# Altium schematic sheet ETHERNET_PLEIADES.SchDoc
size Tabloid; SheetNumber: 7; SheetTotal: 10; Sheet_Name: Insert name in Document Parameters; Size: 11x17
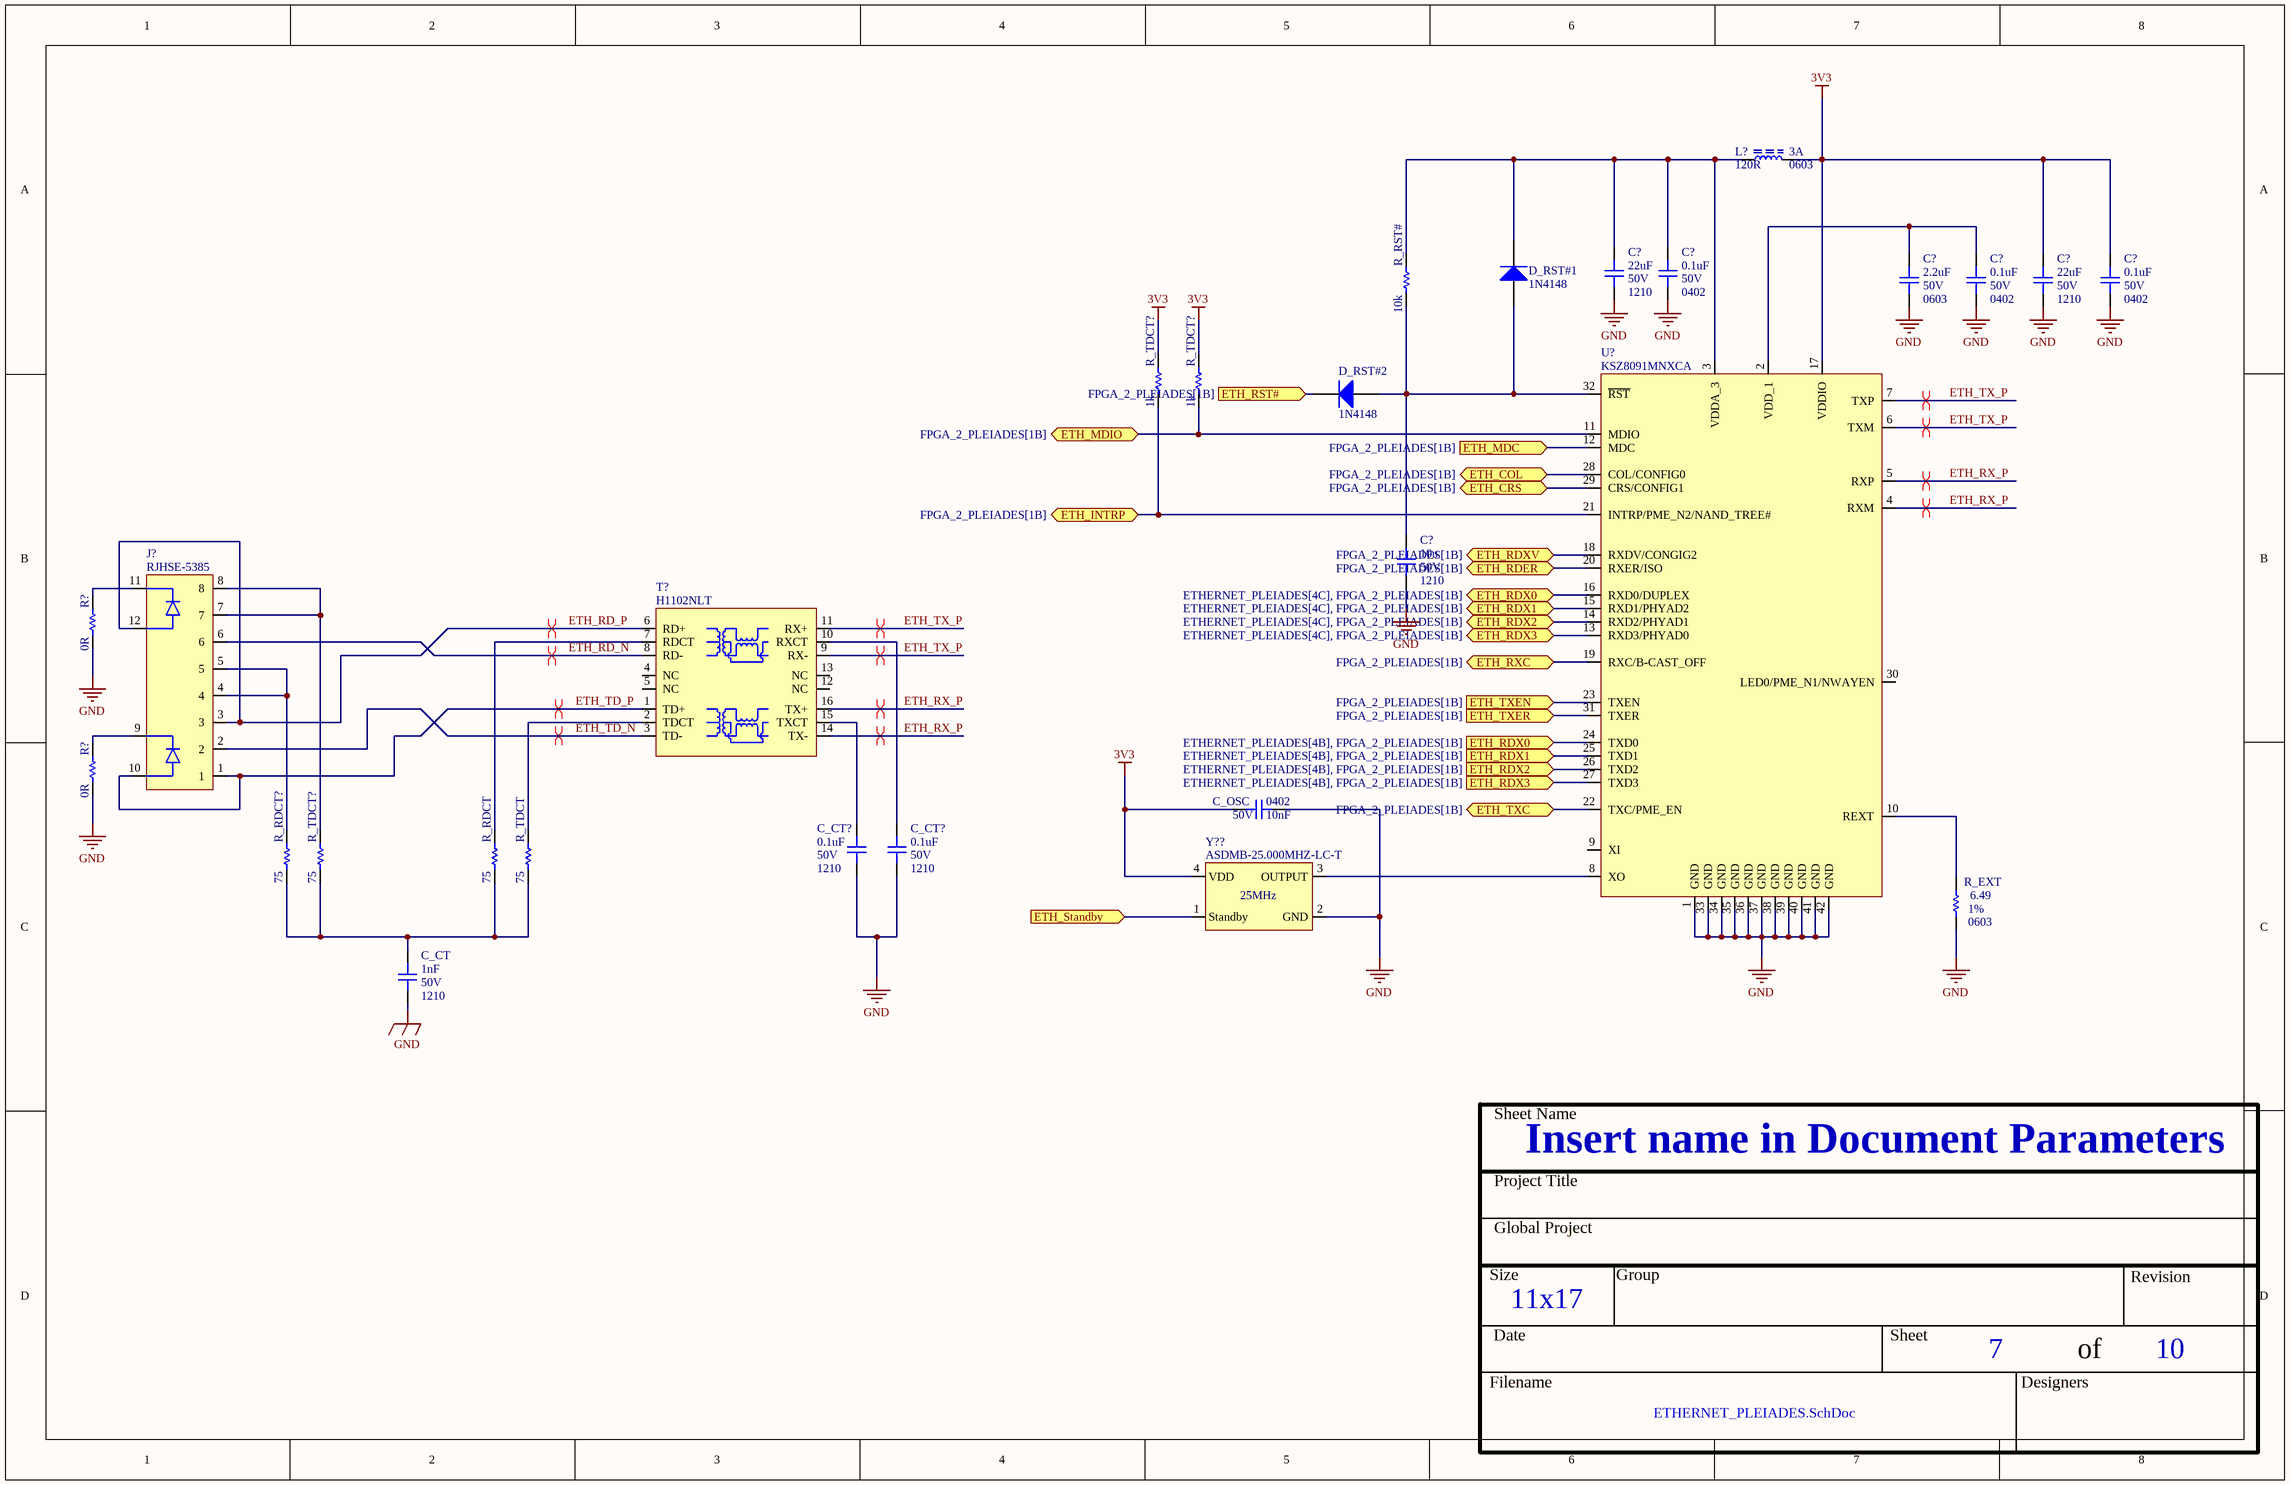
[diagram p0: ETHERNET_PLEIADES.SchDoc]

## Parts
(Parts that share a designator on the sheet are numbered #1, #2 ... from top to bottom, then left to right.)
C?#1  value 22uF  Voltage: 50V  Package: 1210  [CAP_1210]  (hidden comment: CAP - 1210)
C?#2  value 0.1uF  Voltage: 50V  Package: 0402  [CAP_0402]  (hidden comment: CAP - 0402)
C?#3  value 2.2uF  Voltage: 50V  Package: 0603  [CAP_0603]  (hidden comment: CAP - 0603)
C?#4  value 0.1uF  Voltage: 50V  Package: 0402  [CAP_0402]  (hidden comment: CAP - 0402)
C?#5  value 22uF  Voltage: 50V  Package: 1210  [CAP_1210]  (hidden comment: CAP - 1210)
C?#6  value 0.1uF  Voltage: 50V  Package: 0402  [CAP_0402]  (hidden comment: CAP - 0402)
C?#7  value 10u  Voltage: 50V  Package: 1210  [CAP_1210]  (hidden comment: CAP - 1210)
C_CT  value 1nF  Voltage: 50V  Package: 1210  [CAP_1210]  (hidden comment: CAP - 1210)
C_CT?#1  value 0.1uF  Voltage: 50V  Package: 1210  [CAP_1210]  (hidden comment: CAP - 1210)
C_CT?#2  value 0.1uF  Voltage: 50V  Package: 1210  [CAP_1210]  (hidden comment: CAP - 1210)
C_OSC  value 10nF  Voltage: 50V  Package: 0402  [CAP_0402]  (hidden comment: CAP - 0402)
D_RST#1  1N4148  [NXP-SOD27-2_V]
D_RST#2  1N4148  [NXP-SOD27-2_V]
J?  RJHSE-5385  [CONN_ETHERNET_RJHSE-5385]
L?  value 120R  Current: 3A  Package: 0603  [FER_0603]  (hidden comment: FER - 0603)
R?#1  value 0R  [RES_0402]  (hidden comment: RES - 0402)
R?#2  value 0R  [RES_0402]  (hidden comment: RES - 0402)
R_EXT  value 6.49  Package: 0603  Precision: 1%  [RES_0603]  (hidden comment: RES - 0603)
R_RDCT  value 75  [RES_0402]  (hidden comment: RES - 0402)
R_RDCT?  value 75  [RES_0402]  (hidden comment: RES - 0402)
R_RST#  value 10k  [RES_0402]  (hidden comment: RES - 0402)
R_TDCT  value 75  [RES_0402]  (hidden comment: RES - 0402)
R_TDCT?#1  value 1k  [RES_0402]  (hidden comment: RES - 0402)
R_TDCT?#2  value 1k  [RES_0402]  (hidden comment: RES - 0402)
R_TDCT?#3  value 75  [RES_0402]  (hidden comment: RES - 0402)
T?  H1102NLT  [TRANSFO_H1102NLT]
U?  KSZ8091MNXCA  [COM_ETH_PHY_KSZ8091MNXCA]
Y??  ASDMB-25.000MHZ-LC-T  [OSC_ASDMB-25.000MHZ-LC-T]

## Ports
ETH_COL (bidir, see FPGA_2_PLEIADES[1B]), ETH_CRS (bidir, see FPGA_2_PLEIADES[1B]), ETH_INTRP (bidir, see FPGA_2_PLEIADES[1B]), ETH_MDC (in, see FPGA_2_PLEIADES[1B]), ETH_MDIO (bidir, see FPGA_2_PLEIADES[1B]), ETH_RDER (bidir, see FPGA_2_PLEIADES[1B]), ETH_RDX0 (bidir, see ETHERNET_PLEIADES[4C], FPGA_2_PLEIADES[1B]), ETH_RDX0 (in, see ETHERNET_PLEIADES[4B], FPGA_2_PLEIADES[1B]), ETH_RDX1 (bidir, see ETHERNET_PLEIADES[4C], FPGA_2_PLEIADES[1B]), ETH_RDX1 (in, see ETHERNET_PLEIADES[4B], FPGA_2_PLEIADES[1B]), ETH_RDX2 (bidir, see ETHERNET_PLEIADES[4C], FPGA_2_PLEIADES[1B]), ETH_RDX2 (in, see ETHERNET_PLEIADES[4B], FPGA_2_PLEIADES[1B]), ETH_RDX3 (bidir, see ETHERNET_PLEIADES[4C], FPGA_2_PLEIADES[1B]), ETH_RDX3 (in, see ETHERNET_PLEIADES[4B], FPGA_2_PLEIADES[1B]), ETH_RDXV (bidir, see FPGA_2_PLEIADES[1B]), ETH_RST# (in, see FPGA_2_PLEIADES[1B]), ETH_RXC (bidir, see FPGA_2_PLEIADES[1B]), ETH_Standby (in), ETH_TXC (bidir, see FPGA_2_PLEIADES[1B]), ETH_TXEN (in, see FPGA_2_PLEIADES[1B]), ETH_TXER (in, see FPGA_2_PLEIADES[1B])

## Nets
3V3: C?#5.2 C?#6.2 C_OSC.2 L?.1 R_TDCT?#1.2 R_TDCT?#2.2 U?.17(VDDIO) Y??.4(VDD)
GND: C?#1.1 C?#2.1 C?#3.1 C?#4.1 C?#5.1 C?#6.1 C?#7.1 C_CT.1 C_CT?#1.1 C_CT?#2.1 C_OSC.1 R?#1.1 R?#2.1 R_EXT.1 U?.1(GND) U?.33(GND) U?.34(GND) U?.35(GND) U?.36(GND) U?.37(GND) U?.38(GND) U?.39(GND) U?.40(GND) U?.41(GND) U?.42(GND) Y??.2(GND)
ETH_COL: U?.28(COL/CONFIG0) ; port ETH_COL
ETH_CRS: U?.29(CRS/CONFIG1) ; port ETH_CRS
ETH_INTRP: R_TDCT?#1.1 U?.21(INTRP/PME_N2/NAND_TREE#) ; port ETH_INTRP
ETH_MDC: U?.12(MDC) ; port ETH_MDC
ETH_MDIO: R_TDCT?#2.1 U?.11(MDIO) ; port ETH_MDIO
ETH_RD_N: J?.6 T?.8(RD-)
ETH_RD_P: J?.3 J?.12(LED2_A) T?.6(RD+)
ETH_RDER: U?.20(RXER/ISO) ; port ETH_RDER
ETH_RDX0: U?.16(RXD0/DUPLEX) U?.24(TXD0) ; port ETH_RDX0
ETH_RDX1: U?.15(RXD1/PHYAD2) U?.25(TXD1) ; port ETH_RDX1
ETH_RDX2: U?.14(RXD2/PHYAD1) U?.26(TXD2) ; port ETH_RDX2
ETH_RDX3: U?.13(RXD3/PHYAD0) U?.27(TXD3) ; port ETH_RDX3
ETH_RDXV: U?.18(RXDV/CONGIG2) ; port ETH_RDXV
ETH_RST#: D_RST#2.2(K) ; port ETH_RST#
ETH_RX_P: T?.14(TX-) T?.16(TX+) U?.4(RXM) U?.5(RXP)
ETH_RXC: U?.19(RXC/B-CAST_OFF) ; port ETH_RXC
ETH_Standby: Y??.1(Standby) ; port ETH_Standby
ETH_TD_N: J?.2 T?.3(TD-)
ETH_TD_P: J?.1 J?.10(LED1_A) T?.1(TD+)
ETH_TX_P: T?.9(RX-) T?.11(RX+) U?.6(TXM) U?.7(TXP)
ETH_TXC: U?.22(TXC/PME_EN) ; port ETH_TXC
ETH_TXEN: U?.23(TXEN) ; port ETH_TXEN
ETH_TXER: U?.31(TXER) ; port ETH_TXER
NetC?#1_2: C?#1.2 C?#2.2 D_RST#1.2(K) L?.2 R_RST#.2 U?.3(VDDA_3)
NetC?#3_2: C?#3.2 C?#4.2 U?.2(VDD_1)
NetC?#7_2: C?#7.2 D_RST#1.1(A) D_RST#2.1(A) R_RST#.1 U?.32(~{RST})
NetC_CT?#1_2: C_CT?#1.2 T?.15(TXCT)
NetC_CT?#2_2: C_CT?#2.2 T?.10(RXCT)
NetC_CT_2: C_CT.2 R_RDCT.1 R_RDCT?.1 R_TDCT.1 R_TDCT?#3.1
NetJ?_4: J?.4 J?.5 R_RDCT?.2
NetJ?_7: J?.7 J?.8 R_TDCT?#3.2
NetJ?_9: J?.9(LED1_K) R?#2.2
NetJ?_11: J?.11(LED2_K) R?#1.2
NetR_EXT_2: R_EXT.2 U?.10(REXT)
NetR_RDCT_2: R_RDCT.2 T?.7(RDCT)
NetR_TDCT_2: R_TDCT.2 T?.2(TDCT)
NetU?_8: U?.8(XO) Y??.3(OUTPUT)

Not connected (* = marked no-connect by the designer): T? 4(NC) 5(NC) 12(NC) 13(NC); U? 9(XI) 30(LED0/PME_N1/NWAYEN)

## Layout directives
differential pair: ETH_RD_N, ETH_RD_P, ETH_RX_P, ETH_TD_N, ETH_TD_P, ETH_TX_P

## Notes on the sheet
- Sheet Name
- Project Title
- Global Project
- Size
- Group
- Revision
- Date
- Sheet
- of
- Filename
- Designers

## Library data of the parts
C?#1 C?#5 C?#7 C_CT C_CT?#1 C_CT?#2 = CAP - 1210: Precision: 10%; Current: *; CreatedBy: Jonathan Bouchard
  C?#1 C?#5 C?#7 C_CT C_CT?#2: Power: *
  C_CT?#1: Power: 0.1uF
C?#2 C?#4 C?#6 C_OSC = CAP - 0402: Precision: 10%; Current: *; CreatedBy: Jonathan Bouchard; Power: *
C?#3 = CAP - 0603: Precision: 10%; Current: *; CreatedBy: Jonathan Bouchard; Power: *
D_RST#1 D_RST#2 = CMP-004-00000-2: High Speed Diode, 100 V, 0.45 A, -65 to 175 degC, 2-Pin SOD27, RoHS, Bulk; Manufacturer: Fairchild; Elements: 1; Recovery Time: 4ns; Forward Current: 300mA; Power: 500mW; Forward Voltage: 1V; Max Surge Current: 4A; Peak Reverse Current: 5uA; Datasheet URL: http://www.nxp.com/documents/data_sheet/1N4148_1N4448.pdf; Min Operating Temperature: -65°C; Manufacturer URL: https://www.fairchildsemi.com/; Packaging: Bulk; Diameter: 1.91mm; Pins: 2; Package URL: http://www.nxp.com/documents/data_sheet/1N4148_1N4448.pdf; Package Reference: SOD27; Max Operating Temperature: 175°C; Package Quantity: 2000; Case/Package: DO; Datasheet Version: Aug-04; RoHS Compliant: True
J? = CONN_ETHERNET_RJHSE-5385: CONN - MOD JACK RJ45 R/A ETHERNET - TH; Mfg: Amphenol; Voltage: *; Current: *; Power: *; Mfg Part Number: RJHSE-5385; HelpURL: https://www.amphenolcanada.com/ProductSearch/drawings/AC/RJHSE538X.pdf; CreatedBy: Jonathan Bouchard; Temperature: -55°C ~ 85°C; Value: *; Precision: *; Package: TH-12; Supplier 1: Digikey; Supplier Part Number 1: RJHSE-5385-ND
R?#1 R?#2 R_RDCT R_RDCT? R_RST# R_TDCT R_TDCT?#1-R_TDCT?#3 = RES - 0402: Voltage: 50V; Power: 1/16W; Precision: 1%; Current: *; CreatedBy: Jonathan Bouchard; Package: 0402
T? = TRANSFO_H1102NLT: TRANSFO - ETHERNET 10/100B-TX - SMD-16; Mfg: Pulse Eng.; Value: 1:1 (350uH); Voltage: *; Current: *; Power: *; Mfg Part Number: H1102NLT; HelpURL: http://media.digikey.com/pdf/Data%20Sheets/Pulse%20PDFs/10_100BASE-T%20Single%20Port%20SMD%20Magnetics_Rev2008.pdf; CreatedBy: Jonathan Bouchard; Temperature: -40°C to 85°C; Precision: *; Package: SMD-16; Supplier 1: Digikey; Supplier Part Number 1: 553-1532-1-ND
U? = COM_ETH_PHY_KSZ8091MNXCA: COM - ETHERNET PHY 10/100 - QFN-32; Voltage: 1.8V, 2.5V, 3.3V; Mfg: Micrel; Current: *; Power: *; Mfg Part Number: KSZ8091MNXCA; HelpURL: http://ww1.microchip.com/downloads/en/DeviceDoc/00002275A.pdf; CreatedBy: Jonathan Bouchard; Temperature: 0°C ~ 70°C; Value: *; Precision: *; Package: QFN-32; Supplier 1: Digikey; Supplier Part Number 1: 576-4356-ND
Y?? = OSC_ASDMB-25.000MHZ-LC-T: OSC - 25MHz XO (Standard) LVCMOS - 4-SMD, No Lead; Manufacturer #1: Abracon LLC; Tolerance: ±50ppm; Voltage Rating: 1.8V ~ 3.3V; GRAMS Lib Spec: 2.8; Magnetic Material: Unknown; Polarized: Yes; Value: 25MHz; Current Rating: *; Power Max: *; HelpURL: https://abracon.com/Oscillators/ASDMB.pdf; CreatedBy/Date: Joël Lemay 2019-03-29; VerifiedBy: C. Paulin - 29 mai 2019; Temperature: -40°C ~ +85°C; Package: 4-SMD, No Lead; Manufacturer #2: *; Note: *; Assembly Type: SMD; Part Number #2: *; Part Number #1: ASDMB-25.000MHZ-LC-T; Supplier 1: Digi-Key; Supplier Part Number 1: 535-11730-1-ND; Cryo: UNKNOWN
L? = FER - 0603: Voltage: *; CreatedBy: Jonathan Bouchard; Power: *; Precision: *
R_EXT = RES - 0603: Current: *; CreatedBy: Jonathan Bouchard